# EAGLE schematic POWERSUPPLAY (EAGLE 9.6.2)
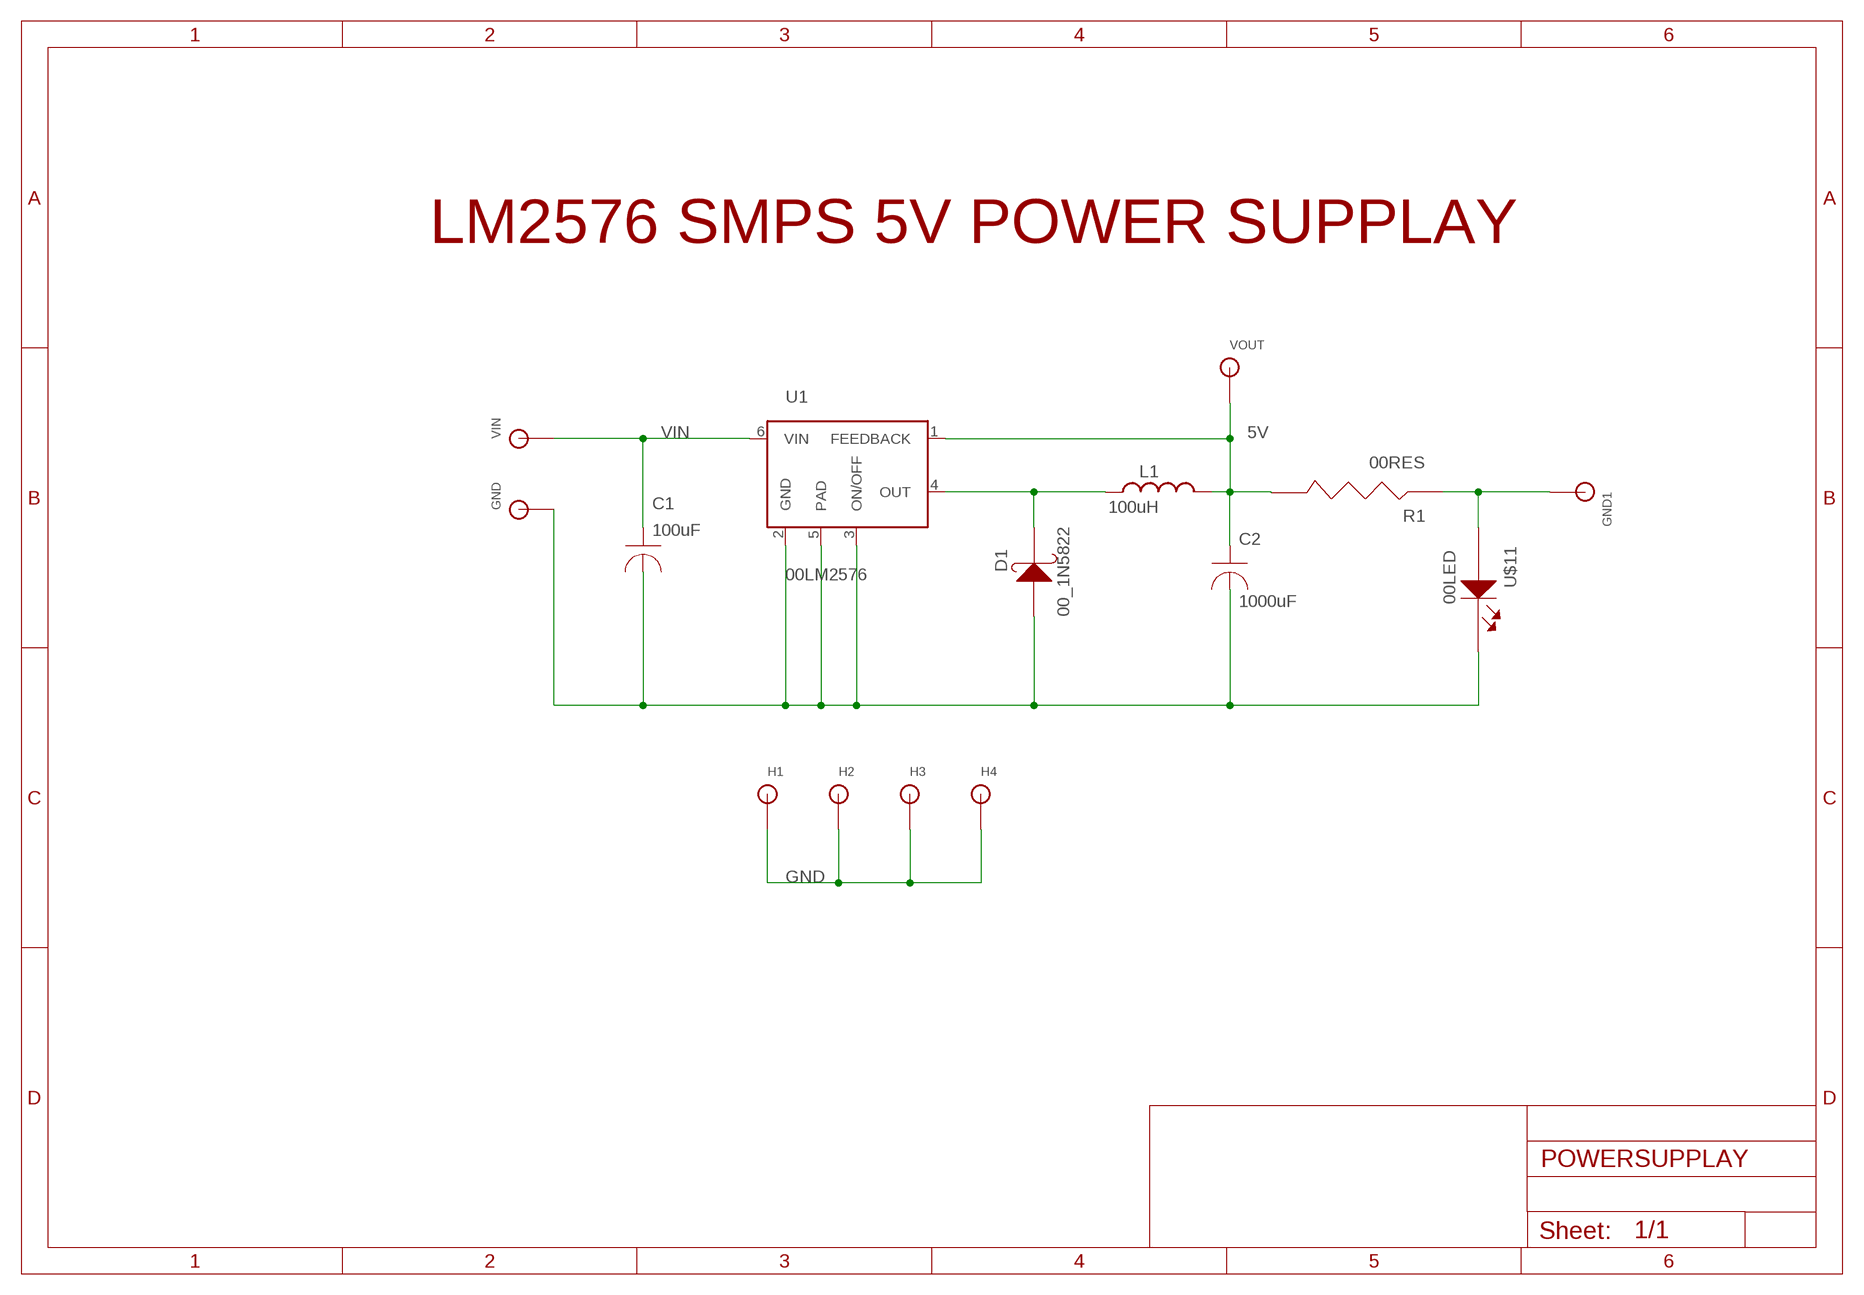
[diagram p0: schematic, sheet 1]

## Parts
C1  100uF  00CAP  [00CAP]
C2  1000uF  00CAP  [00CAP]
D1  00_1N5822  [00_1N5822]
GND  00PAD  [00PAD]
GND1  MH_HOLE  [00PAD]
H1  MH_HOLE  [00PAD]
H2  MH_HOLE  [00PAD]
H3  MH_HOLE  [00PAD]
H4  MH_HOLE  [00PAD]
L1  100uH  01INDUCTOR  [01INDUCTOR]
R1  00RES  [00RES]
U1  00LM2576  [00LM2576]
U$11  00LED  [0805_LED]
VIN  00PAD  [00PAD]
VOUT  MH_HOLE  [00PAD]

## Nets
5V: C2.1 L1.2 R1.2 U1.1(FEEDBACK) VOUT.1
GND: H1.1 H2.1 H3.1 H4.1
N$1: D1.2 L1.1 U1.4(OUT)
N$3: C1.2 C2.2 D1.1 GND.1 U1.2(GND) U1.3(ON/OFF) U1.5(PAD) U$11.2
N$5: GND1.1 R1.1 U$11.1
VIN: C1.1 U1.6(VIN) VIN.1

## Notes on the sheet
- LM2576 SMPS 5V POWER SUPPLAY

## Library data of the parts
C1 C2 = 00CAP:00CAP
D1 = 00_1N5822:00_1N5822
GND VIN = 00PAD:00PAD
GND1 H1-H4 VOUT = 00PAD:MH_HOLE
L1 = 01INDUCTOR:01INDUCTOR
R1 = 00RES:00RES
U1 = 00LM7576:00LM2576
U$11 = 00LED:00LED